# EAGLE design L6201PS_Small (EAGLE 7.2.0)
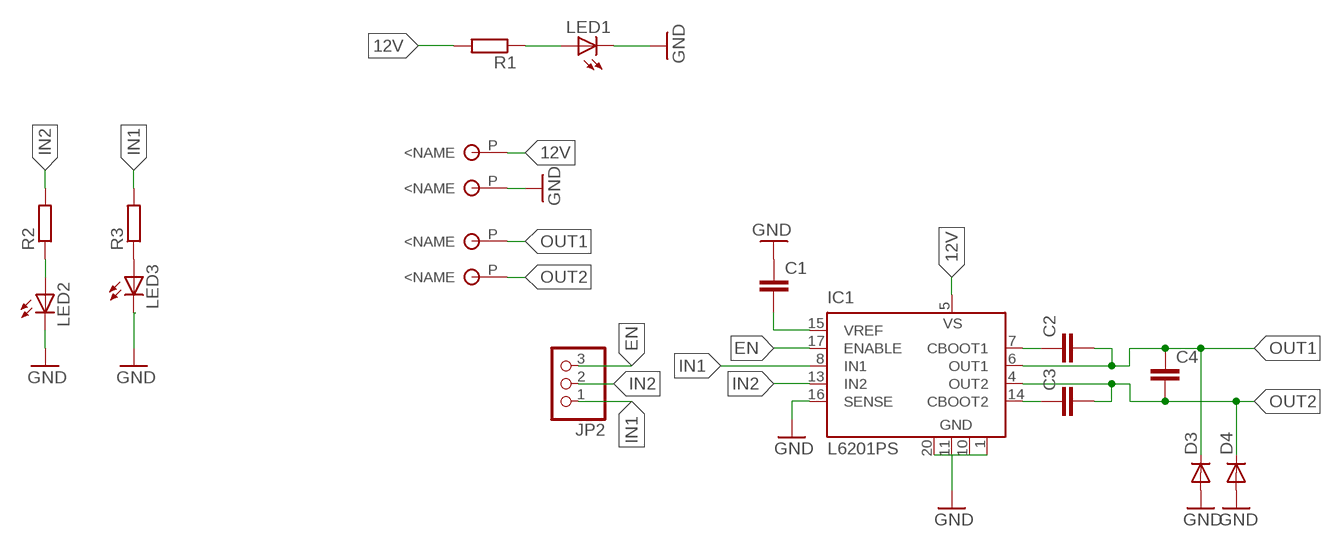
[diagram p0: schematic, sheet 1]

## Parts
C1  C-EUC0603  [C0603]
C2  C-EUC0603  [C0603]
C3  C-EUC0603  [C0603]
C4  C-EUC0603  [C0603]
D3  DIODE-DO214AC  [DO214AC]
D4  DIODE-DO214AC  [DO214AC]
IC1  L6201PS  [POWERSO-20]
JP2  PINHD-1X3  [1X03]
LED1  LEDSML0603  [SML0603]
LED2  LEDSML0603  [SML0603]
LED3  LEDSML0603  [SML0603]
R1  R-EU_R0603  [R0603]
R2  R-EU_R0603  [R0603]
R3  R-EU_R0603  [R0603]
U$1  CU-SPACER  [CU-SPACER]
U$2  CU-SPACER  [CU-SPACER]
U$3  CU-SPACER  [CU-SPACER]
U$4  CU-SPACER  [CU-SPACER]

## Nets
12V: IC1.5(VS) R1.2 U$2.P(<NAME)
EN: IC1.17(ENABLE) JP2.3
GND: C1.1 D3.A D4.A IC1.1(GND) IC1.10(GND) IC1.11(GND) IC1.16(SENSE) IC1.20(GND) LED1.C LED2.C LED3.C U$1.P(<NAME)
IN1: IC1.8(IN1) JP2.1 R3.2
IN2: IC1.13(IN2) JP2.2 R2.2
N$1: LED3.A R3.1
N$3: LED1.A R1.1
N$5: C1.2 IC1.15(VREF)
N$6: C2.1 IC1.7(CBOOT1)
N$9: LED2.A R2.1
N$11: C3.1 IC1.14(CBOOT2)
OUT1: C2.2 C4.1 D3.C IC1.6(OUT1) U$3.P(<NAME)
OUT2: C3.2 C4.2 D4.C IC1.4(OUT2) U$4.P(<NAME)

## Library data of the parts
C1-C4 = rcl:C-EU: CAPACITOR, European symbol
D3 D4 = diode:DIODE-: DIODE
IC1 = st-microelectronics:L6201: DMOS FULL BRIDGE DRIVER; MF: Arrow Electronics; MPN: L6201PS; OC_FARNELL: 1077146; OC_NEWARK: 89K0751
JP2 = pinhead:PINHD-1X3: PIN HEADER
LED1-LED3 = led:LED: LED OSRAM: - CHIPLED LG R971, LG N971, LY N971, LG Q971, LY Q971, LO R971, LY R971 LH N974, LH R974 LS Q976, LO Q976, LY Q976 LO Q996 - Hyper CHIPLED LW Q18S LB Q993, LB Q99A, LB R99A - SideLED LS A670, LO A670, LY A670, LG A670, LP A670 LB A673, LV A673, LT A673, LW A673 LH A674 LY A675 LS A676, LA A676, LO A676, LY A676, LW A676 LS A679, LY A679, LG A679 - Hyper Micro SIDELED® LS Y876, LA Y876, LO Y876, LY Y876 LT Y87S - SmartLED LW L88C, LW L88S LB L89C, LB L89S, LG L890 LS L89K, LO L89K, LY L89K LS L896, LA L896, LO L896, LY L896 - TOPLED LS T670, LO T670, LY T670, LG T670, LP T670 LSG T670, LSP T670, LSY T670, LOP T670, LYG T670 LG T671, LOG T671, LSG T671 LB T673, LV T673, LT T673, LW T673 LH T674 LS T676, LA T676, LO T676, LY T676, LB T676, LH T676, LSB T676, LW T676 LB T67C, LV T67C, LT T67C, LS T67K, LO T67K, LY T67K, LW E67C LS E67B, LA E67B, LO E67B, LY E67B, LB E67C, LV E67C, LT E67C LW T67C LS T679, LY T679, LG T679 LS T770, LO T770, LY T770, LG T770, LP T770 LB T773, LV T773, LT T773, LW T773 LH T774 LS E675, LA E675, LY E675, LS T675 LS T776, LA T776, LO T776, LY T776, LB T776 LHGB T686 LT T68C, LB T68C - Hyper Mini TOPLED® LB M676 - Mini TOPLED Santana® LG M470 LS M47K, LO M47K, LY M47K Source: http://www.osram.convergy.de LUXEON: - LUMILED® LXK2-PW12-R00, LXK2-PW12-S00, LXK2-PW14-U00, LXK2-PW14-V00 LXK2-PM12-R00, LXK2-PM12-S00, LXK2-PM14-U00 LXK2-PE12-Q00, LXK2-PE12-R00, LXK2-PE12-S00, LXK2-PE14-T00, LXK2-PE14-U00 LXK2-PB12-K00, LXK2-PB12-L00, LXK2-PB12-M00, LXK2-PB14-N00, LXK2-PB14-P00, LXK2-PB14-Q00 LXK2-PR12-L00, LXK2-PR12-M00, LXK2-PR14-Q00, LXK2-PR14-R00 LXK2-PD12-Q00, LXK2-PD12-R00, LXK2-PD12-S00 LXK2-PH12-R00, LXK2-PH12-S00 LXK2-PL12-P00, LXK2-PL12-Q00, LXK2-PL12-R00 Source: www.luxeon.com KINGBRIGHT: KA-3528ASYC Source: www.kingbright.com
R1-R3 = rcl:R-EU_: RESISTOR, European symbol
U$1-U$4 = Aquaphoton:CU-SPACER

## Board
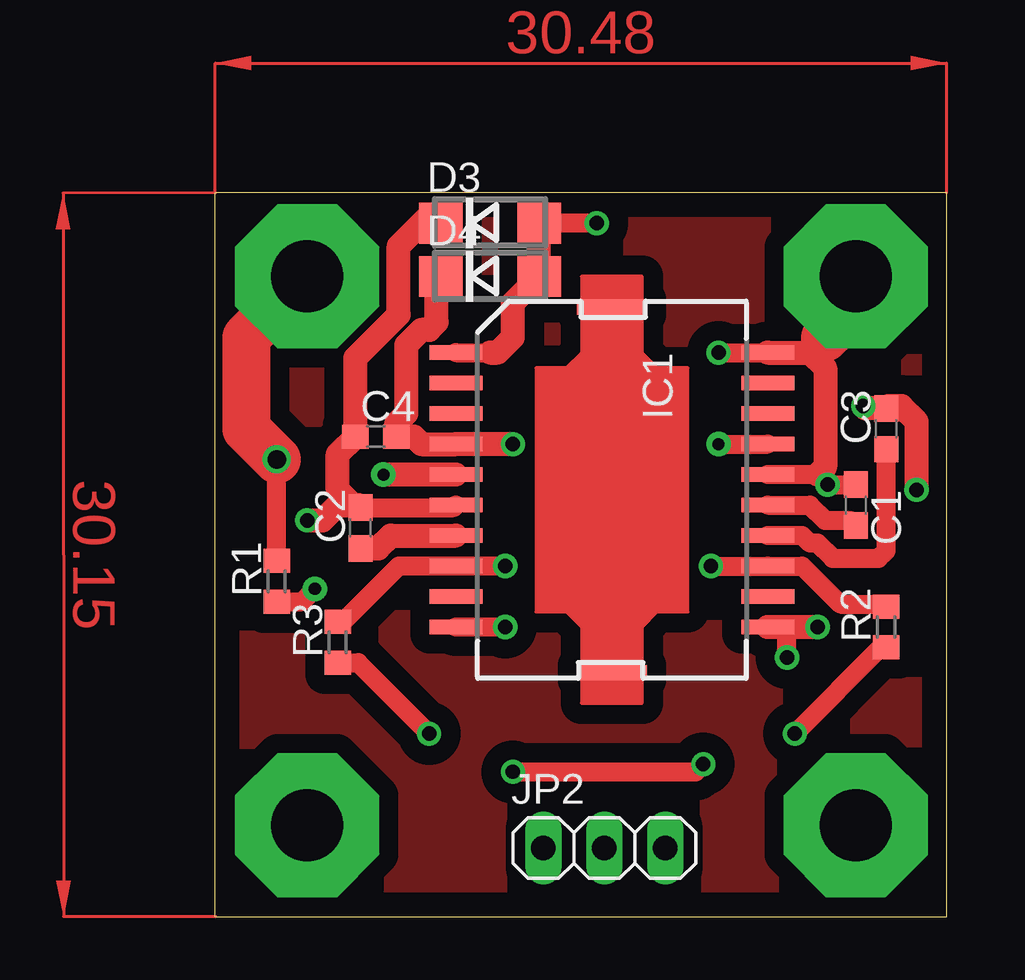
[diagram p1: board, top side]
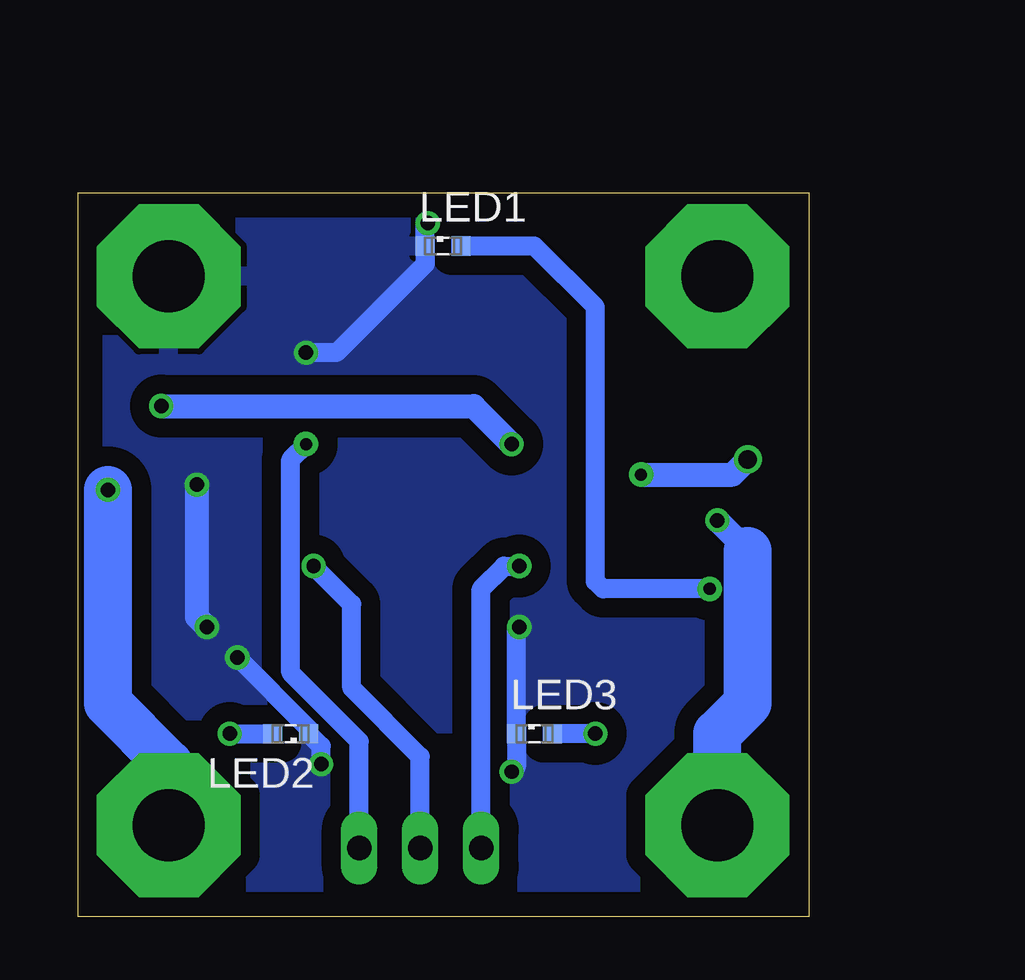
[diagram p2: board, bottom side, seen from below]

Size 30.48 x 30.15 mm. Coordinates in mm from the lower left corner, seen from the top.
Outline: 0.02,0 30.48,0 30.48,30.15 0.02,30.15
Outline: 0,0 0,30.15
Copper layers (1*16): Top 0.035mm / dielectric 1.5mm / Bottom 0.035mm
Design rules "default *": minimum track width 10mil, minimum drill 24mil, track to track 0.8mm, track to pad 0.8mm, pad to pad 8mil, via to via 8mil, smd to smd 8mil, copper to edge 40mil, drill to drill 8mil, minimum pad ring 10mil, minimum via ring 8mil, stop-mask expansion 4mil, vias tented up to drill 0mil, thermal gap 10mil

### Footprints (pad centres in the part's own frame; a part is rotated, then mirrored left to right if it is on the bottom)
C0603 = smd 1.1 x 1: 1 -0.85,0; 2 0.85,0
DO214AC = smd 1.8 x 1.7: A 2.05,0; C -2.05,0
POWERSO-20 = smd 0.6 x 2.2: 1 -5.715,-6.5; 2 -4.445,-6.5; 3 -3.175,-6.5; 4 -1.905,-6.5; 5 -0.635,-6.5; 6 0.635,-6.5; 7 1.905,-6.5; 8 3.175,-6.5; 9 4.445,-6.5; 10 5.715,-6.5; 11 5.715,6.5; 12 4.445,6.5; 13 3.175,6.5; 14 1.905,6.5; 15 0.635,6.5; 16 -0.635,6.5; 17 -1.905,6.5; 18 -3.175,6.5; 19 -4.445,6.5; 20 -5.715,6.5 | smd 0.635 x 2.9: P$1 -7.62,0; P$2 7.62,0
1X03 = drill 1.016 long: 1 -2.54,0; 2 0,0; 3 2.54,0
SML0603 = smd 0.8 x 0.8: A 0.75,0; C -0.75,0
R0603 = smd 1 x 1.1: 1 -0.85,0; 2 0.85,0
CU-SPACER = drill 3 pad 6 octagon: P 0,0

### Placement (x,y rotation side)
C1  26.69,17.14 270 top
C2  6.05,16.19 90 top
C3  27.96,20.32 90 top
C4  6.69,20 0 top
D3  11.45,28.89 0 top
D4  11.45,26.67 0 top
IC1  16.53,17.78 270 top
JP2  16.21,2.86 0 top
LED1  15.26,27.94 0 bottom
LED2  21.61,7.62 180 bottom
LED3  11.45,7.62 0 bottom
R1  2.56,13.97 90 top
R2  27.96,12.06 90 top
R3  5.1,11.43 90 top
U$1  26.69,26.67 0 top
U$2  3.83,26.67 0 top
U$3  3.83,3.81 0 top
U$4  26.69,3.81 0 top

### Tracks (layer width: path | path; a pad name or v marks a point on that pad's centre or on a via)
12V  (via drill 0.51 pad 1.02, 0.76 pad 1.02)
  Top 0.8: R1.2 v2.56,19.05
  Top 1: IC1.5 v7,18.41
  Top 2: U$2.P 1.29,24.13 1.29,20.32 v2.56,19.05
  Bottom 1: v7,18.41 3.19,18.41 v2.56,19.05
EN  (via drill 0.51 pad 1.02)
  Top 0.8: v20.97,19.68 IC1.17
  Bottom 0.8: v20.97,19.68 21.61,19.05 21.61,10.16 18.75,7.3 JP2.3
GND  (via drill 0.6)
  Top 0.8: IC1.16 25.1,18.41 v25.52,18 C1.1 | 24.79,23.5 25.42,24.13 | IC1.1 11.45,23.5 | v15.89,28.89 D3.A | v20.97,23.5 IC1.20 | v12.08,12.06 IC1.10 | v12.4,6.03 20.02,6.03 v20.34,6.35 | v23.83,10.79 23.83,11.75 24.15,12.06
  Top 1: D3.A D4.A 12.4,25.57 12.4,24.13 11.77,23.5 11.45,23.5 | IC1.20 24.79,23.5 25.42,22.86 25.42,18.73 25.1,18.41 | v25.1,12.06 24.15,12.06 IC1.11
  Top 2: U$1.P 26.69,25.4 25.42,24.13
  Bottom 0.8: v15.89,28.89 16.01,28.78 LED1.C 16.01,27.19 19.7,23.5 v20.97,23.5 | v12.08,12.06 12.2,11.95 LED3.C 12.2,6.24 v12.4,6.03 | v20.34,6.35 20.34,7.1 LED2.C 20.86,7.82 v23.83,10.79
  Bottom 1: v25.52,18 25.52,12.48 v25.1,12.06
  pour Bottom: 0.02,30.48 30.5,30.48 30.5,29.21 30.5,0 0.02,0
IN1  (via drill 0.6)
  Top 0.8: R3.2 5.2,12.38 5.42,12.38 7.64,14.61 IC1.8 v12.08,14.61
  Bottom 0.8: JP2.1 13.67,13.65 12.72,14.61 v12.08,14.61
IN2  (via drill 0.6)
  Top 0.8: R2.2 27.86,13.02 26.05,13.02 24.47,14.61 IC1.13 v20.66,14.61
  Bottom 0.8: JP2.2 16.21,6.67 19.07,9.53 19.07,13.02 v20.66,14.61
N$1  (via drill 0.6)
  Top 0.8: R3.1 5.95,10.58 v8.91,7.62
  Bottom 0.8: v8.91,7.62 LED3.A
N$2
  pour Top: 0.02,30.48 30.5,30.48 30.5,29.21 30.5,0 0.02,0
N$3  (via drill 0.51 pad 1.02)
  Top 0.8: R1.1 3.62,13.12 v4.15,13.65
  Bottom 0.8: v4.15,13.65 8.59,13.65 8.91,13.97 8.91,25.4 11.45,27.94 LED1.A
N$5
  Top 0.8: IC1.15 24.79,17.14 25.42,16.51 26.47,16.51 C1.2
N$6
  Top 1: C2.1 6.79,15.34 7.32,15.88 IC1.7
N$9  (via drill 0.6)
  Top 0.8: R2.1 27.75,11.21 v24.15,7.62
  Bottom 0.8: v24.15,7.62 LED2.A
N$11
  Top 0.8: IC1.14 24.47,15.88 24.79,15.56 25.1,15.56 25.74,14.92 27.64,14.92 27.96,15.24 C3.1
OUT1  (via drill 0.6)
  Top 0.8: C2.2 9.93,17.04 IC1.6 | 8.91,29.21 9.4,29.21 D3.C
  Top 1: v3.83,16.51 4.46,16.51 5.1,17.14 5.73,17.14 | C2.2 5.95,17.14 5.73,17.14 | 5.73,17.14 5.1,17.78 5.1,19.27 C4.1 5.84,23.28 7.64,25.08 7.64,27.94 8.91,29.21
  Bottom 1: 2.56,15.24 v3.83,16.51
  Bottom 2: U$3.P 3.83,7.62 2.56,8.89 2.56,15.24
OUT2  (via drill 0.6)
  Top 1: v29.23,17.78 29.23,20.64 28.59,21.27 28.06,21.27 C3.2 27.11,21.17 v27.01,21.27 | v12.4,19.68 IC1.4 8.59,19.68 8.28,20 C4.2 7.54,20.54 7.96,20.95 7.96,23.81 8.59,24.45 8.91,24.45 9.23,24.77 9.23,26.5 D4.C
  Bottom 1: v27.01,21.27 13.99,21.27 v12.4,19.68
  Bottom 2: U$4.P 26.69,6.35 29.23,8.89 v29.23,17.78
(copper drawn outside any net)
  shapes: Top area x2